# EAGLE design PersonalPCR_EagleCad_v1 (EAGLE 5.11)
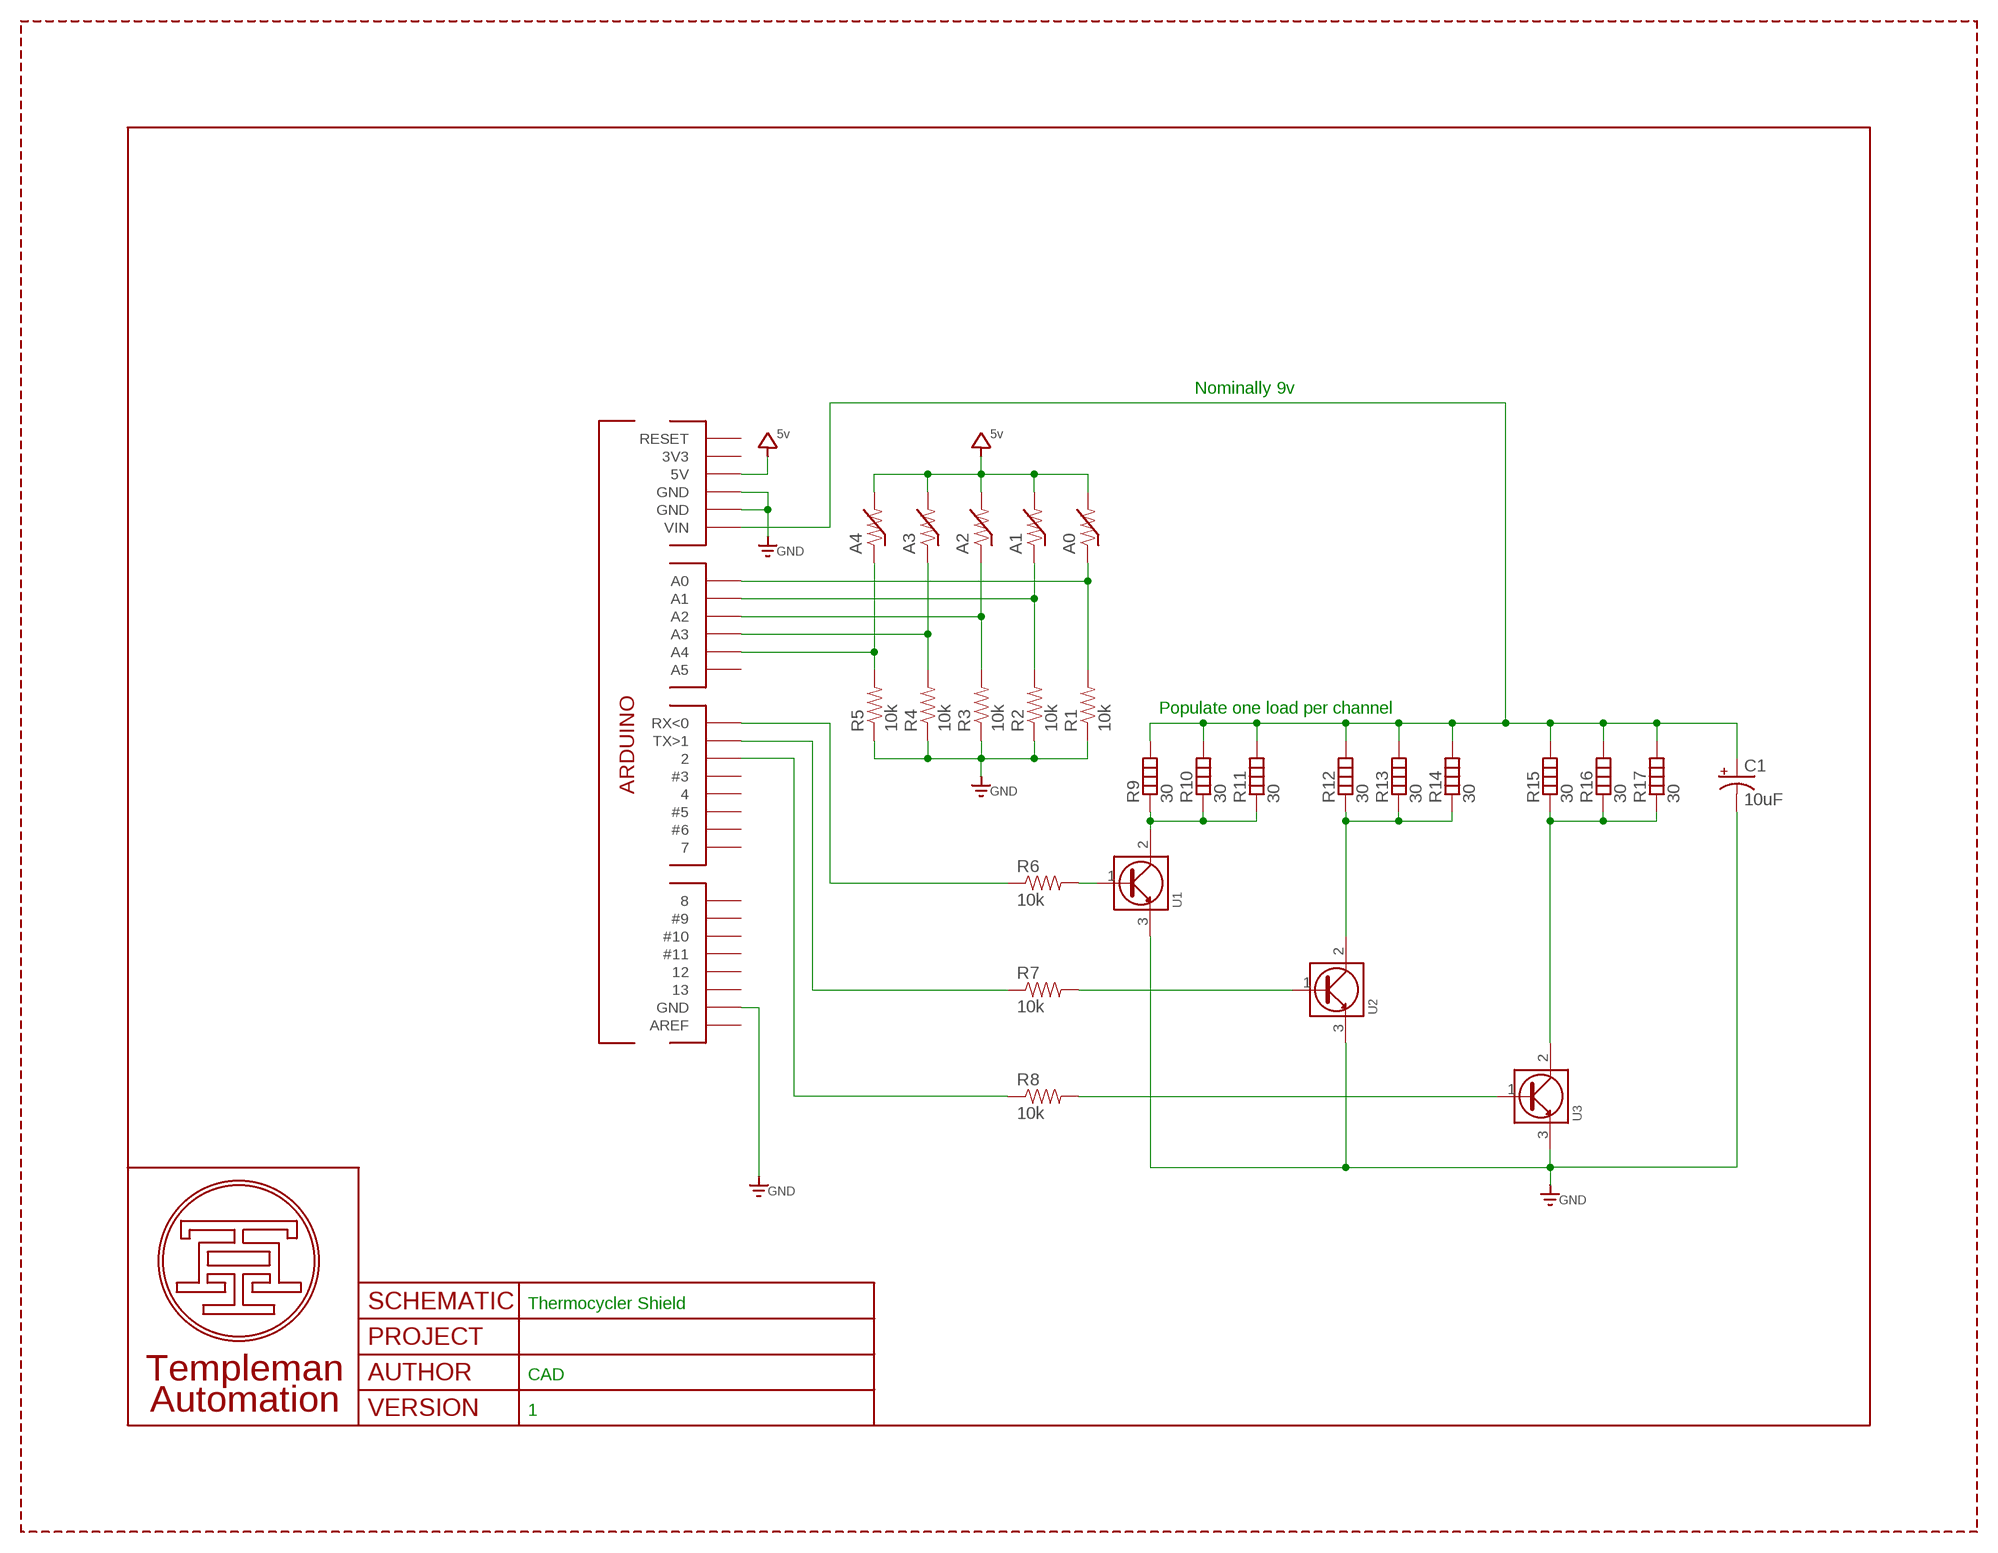
[diagram p0: schematic, sheet 1]

## Parts
A0  THERMISTOR_HEADER  [HEADER_2PIN]
A1  THERMISTOR_HEADER  [HEADER_2PIN]
A2  THERMISTOR_HEADER  [HEADER_2PIN]
A3  THERMISTOR_HEADER  [HEADER_2PIN]
A4  THERMISTOR_HEADER  [HEADER_2PIN]
C1  10uF  CAP_POLPANASONIC_EB_A  [CPOL-RADIAL_5MMCASE_2MMPINS]
R1  10k  RESISTOR2512W  [2512_WIDE]
R2  10k  RESISTOR2512W  [2512_WIDE]
R3  10k  RESISTOR2512W  [2512_WIDE]
R4  10k  RESISTOR2512W  [2512_WIDE]
R5  10k  RESISTOR2512W  [2512_WIDE]
R6  10k  RESISTOR1206  [1206]
R7  10k  RESISTOR1206  [1206]
R8  10k  RESISTOR1206  [1206]
R9  30  RESISTOR_HEATER_2512  [2512]
R10  30  RESISTOR_HEATER_HEADER  [HEADER_2PIN]
R11  30  RESISTOR_HEATER_BIGBLOCK  [RECTILINEAR_RESISTOR]
R12  30  RESISTOR_HEATER_2512  [2512]
R13  30  RESISTOR_HEATER_HEADER  [HEADER_2PIN]
R14  30  RESISTOR_HEATER_BIGBLOCK  [RECTILINEAR_RESISTOR]
R15  30  RESISTOR_HEATER_2512  [2512]
R16  30  RESISTOR_HEATER_HEADER  [HEADER_2PIN]
R17  30  RESISTOR_HEATER_BIGBLOCK  [RECTILINEAR_RESISTOR]
U1  NPN_BJT_SOT223  [SOT-223]
U2  NPN_BJT_SOT223  [SOT-223]
U3  NPN_BJT_SOT223  [SOT-223]
U$1  PAPER_LETTER_LANDSCAPE  [NULL]
U$2  ARDUINO_SHIELD  [ARDUINO_UNO_SHIELD]

## Nets
5V: A0.2 A1.2 A2.2 A3.2 A4.2 U$2.5V ; supply symbol labelled SYM_5V
GND: C1.- R1.1 R2.1 R3.1 R4.1 R5.1 U1.3(E) U2.3(E) U3.3(E) U$2.GND@1(GND) U$2.GND@2(GND) U$2.GND@3(GND) ; supply symbol labelled SYM_GND
N$1: C1.+ R9.2 R10.2 R11.2 R12.2 R13.2 R14.2 R15.2 R16.2 R17.2 U$2.VIN
N$2: A0.1 R1.2 U$2.A0
N$3: A1.1 R2.2 U$2.A1
N$4: R6.1 U$2.RX<0
N$5: R7.1 U$2.TX>1
N$6: R8.1 U$2.2
N$7: R6.2 U1.1(B)
N$8: R7.2 U2.1(B)
N$9: R8.2 U3.1(B)
N$10: A2.1 R3.2 U$2.A2
N$11: A3.1 R4.2 U$2.A3
N$12: A4.1 R5.2 U$2.A4
N$13: R9.1 R10.1 R11.1 U1.2(C)
N$14: R12.1 R13.1 R14.1 U2.2(C)
N$15: R15.1 R16.1 R17.1 U3.2(C)
Unconnected: U$2.3(#3) U$2.3V3 U$2.4 U$2.5(#5) U$2.6(#6) U$2.7 U$2.8 U$2.9(#9) U$2.10(#10) U$2.11(#11) U$2.12 U$2.13 U$2.A5 U$2.AREF U$2.RESET

## Notes on the sheet
- Nominally 9v
- Populate one load per channel
- Thermocycler Shield
- CAD
- 1

## Library data of the parts
A0 A1-A4 = templeman:THERMISTOR
C1 = templeman:CAP_POL: Capacitor Polarized These are standard SMD and PTH capacitors. Normally 10uF, 47uF, and 100uF in electrolytic and tantalum varieties. Always verify the external diameter of the through hole cap, it varies with capacity, voltage, and manufacturer. The EIA devices should be standard.
R1-R8 = templeman:RESISTOR: Resistor Basic schematic elements and footprints for 0603, 1206, and PTH 1/10th watt (small) resistors.
R9-R17 = templeman:RESISTOR_HEATER
U1-U3 = templeman:NPN_BJT
U$1 = templeman:PAPER_LETTER_LANDSCAPE: Layout for Standard Letter Paper
U$2 = templeman:ARDUINO_SHIELD

## Board
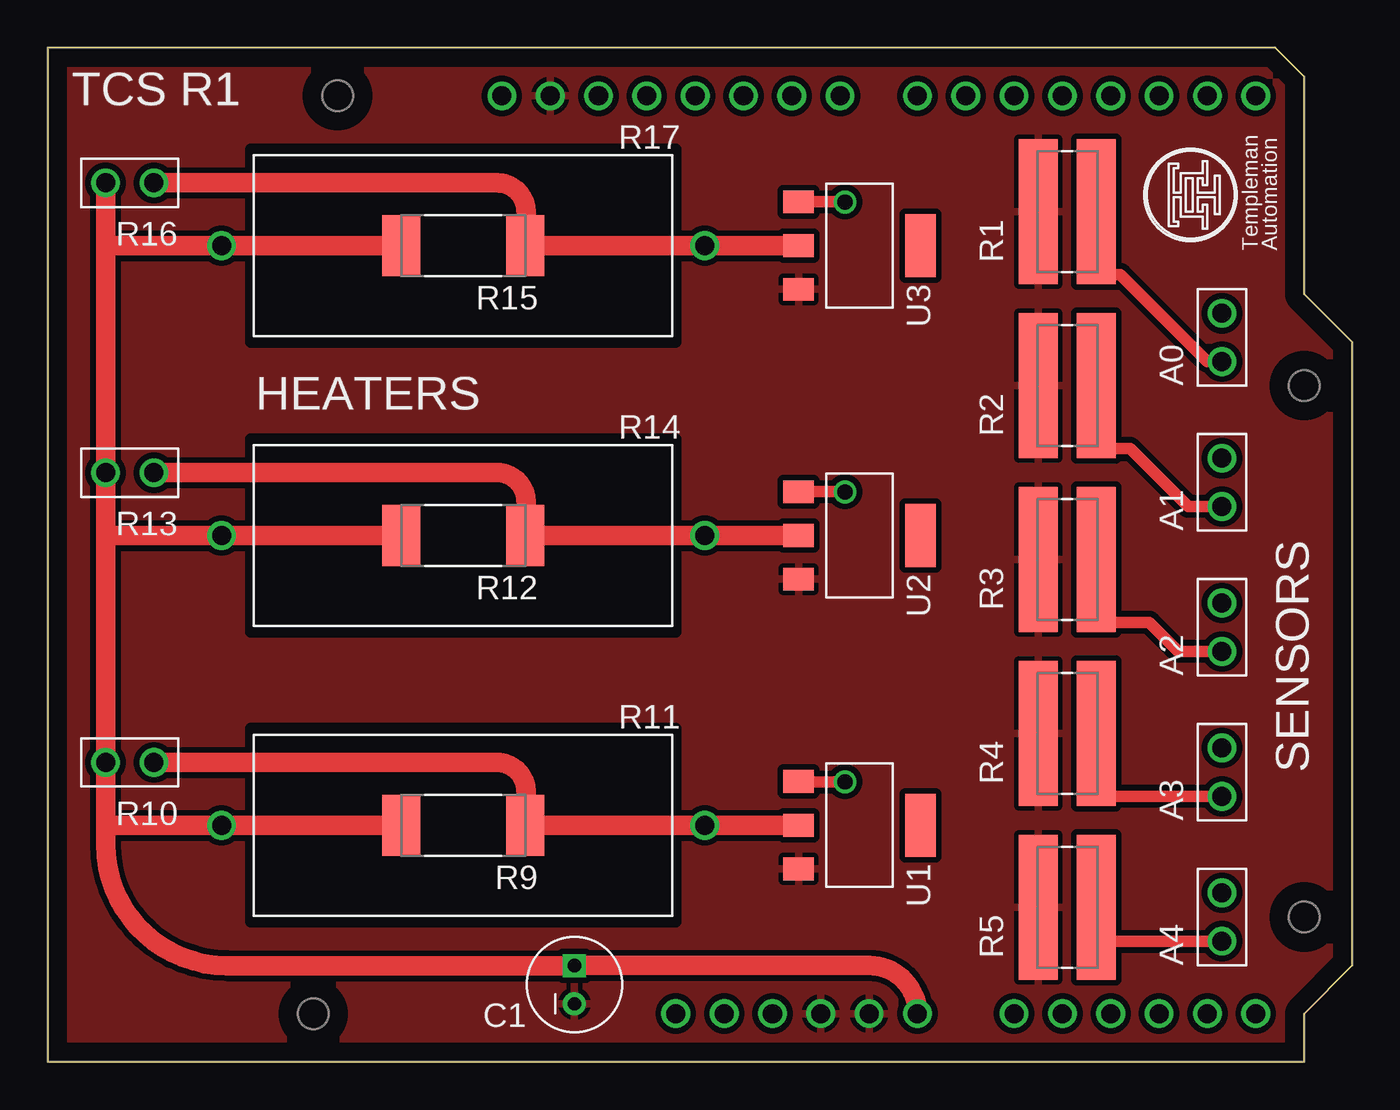
[diagram p1: board, top side]
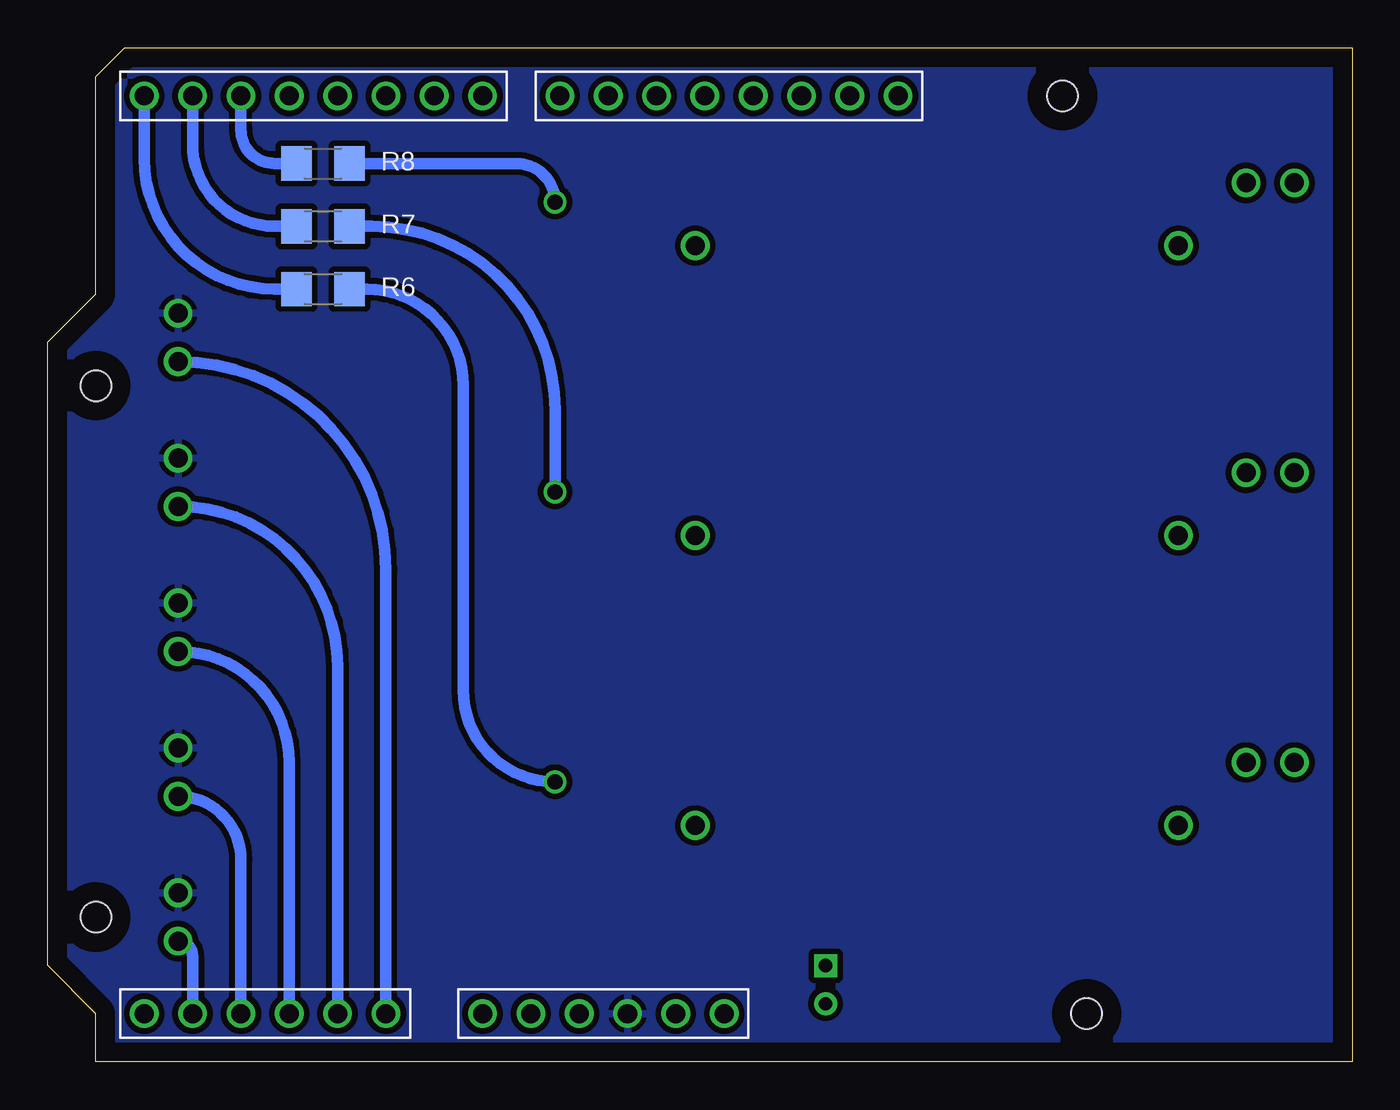
[diagram p2: board, bottom side, seen from below]

Size 68.58 x 53.34 mm. Coordinates in mm from the lower left corner, seen from the top.
Outline: 0,0 66.04,0 66.04,2.54 68.58,5.08 68.58,37.85 66.04,40.39 66.04,51.82 64.52,53.34 0,53.34 0,0
Copper layers (1*16): Top 0.035mm / dielectric 1.5mm / Bottom 0.035mm
Design rules "barebones": minimum track width 10mil, minimum drill 15mil, track to track 12mil, track to pad 12mil, pad to pad 12mil, via to via 12mil, smd to smd 12mil, copper to edge 40mil, drill to drill 12mil, minimum pad ring 10mil, minimum via ring 8mil, stop-mask expansion 4mil, vias tented up to drill 0mil, thermal gap 10mil
Holes 1.6 mm at 13.97,2.54 15.24,50.8 66.04,35.56 66.04,7.62
tRestrict: area 10.7,37.8 to 33,48; area 10.7,22.6 to 33,32.8; area 10.7,7.4 to 33,17.5

### Footprints (pad centres in the part's own frame; a part is rotated, then mirrored left to right if it is on the bottom)
HEADER_2PIN = drill 1 round: 1 0,0; 2 2.54,0
CPOL-RADIAL_5MMCASE_2MMPINS = drill 0.7 square: + 1,0 | drill 0.7 round: - -1,0
2512_WIDE = smd 2.032 x 7.62: 1 -1.524,0; 2 1.524,0
1206 = smd 1.6 x 1.8: 1 -1.4,0; 2 1.4,0
2512 = smd 2 x 3.2: 1 -3.25,0; 2 3.25,0
RECTILINEAR_RESISTOR = drill 1 round: 1 -12.7,0; 2 12.7,0
SOT-223 = smd 1.2 x 1.6: 1 -2.3,-3.2; 2 0,-3.2; 3 2.3,-3.2 | smd 3.3 x 1.6: 4 0,3.2
ARDUINO_UNO_SHIELD = drill 1 round: 2 -5.08,48.26; 3 -7.62,48.26; 3V3 -27.94,0; 4 -10.16,48.26; 5 -12.7,48.26; 5V -25.4,0; 6 -15.24,48.26; 7 -17.78,48.26; 8 -21.844,48.26; 9 -24.384,48.26; 10 -26.924,48.26; 11 -29.464,48.26; 12 -32.004,48.26; 13 -34.544,48.26; A0 -12.7,0; A1 -10.16,0; A2 -7.62,0; A3 -5.08,0; A4 -2.54,0; A5 0,0; AREF -39.624,48.26; GND@1 -22.86,0; GND@2 -20.32,0; GND@3 -37.084,48.26; RESET -30.48,0; RX<0 0,48.26; TX>1 -2.54,48.26; VIN -17.78,0

### Placement (x,y rotation side)
A0  61.72,36.83 90 top
A1  61.72,29.21 90 top
A2  61.72,21.59 90 top
A3  61.72,13.97 90 top
A4  61.72,6.35 90 top
C1  27.69,4.06 90 top
R1  53.59,44.7 0 top
R2  53.59,35.56 0 top
R3  53.59,26.42 0 top
R4  53.59,17.27 0 top
R5  53.59,8.13 0 top
R6  54.1,40.64 0 bottom
R7  54.1,43.94 0 bottom
R8  54.1,47.24 0 bottom
R9  21.84,12.45 180 top
R10  5.59,15.75 180 top
R11  21.84,12.45 180 top
R12  21.84,27.69 180 top
R13  5.59,30.99 180 top
R14  21.84,27.69 180 top
R15  21.84,42.93 180 top
R16  5.59,46.23 180 top
R17  21.84,42.93 180 top
U1  42.67,12.45 270 top
U2  42.67,27.69 270 top
U3  42.67,42.93 270 top
U$1  1.27,1.27 0 top
U$2  63.5,2.54 0 top
U$8  [LOGO-TA]  59.44,45.21 90 top

### Tracks (layer width: path | path; a pad name or v marks a point on that pad's centre or on a via)
5V
  pour Bottom: 0,0 66.04,0 66.04,2.54 68.58,5.08 68.58,37.85 66.04,40.39 66.04,51.82 64.52,53.34 0,53.34
GND
  pour Top: 0,53.34 64.52,53.34 66.04,51.82 66.04,40.39 68.58,37.85 68.58,5.08 66.04,2.54 66.04,0 0,0
N$1
  Top 1.016: 3.05,12.45 R10.2 3.05,27.69 | 3.05,12.45 R11.2 R9.2 | 3.05,27.69 R13.2 3.05,42.93 | 3.05,42.93 R16.2 | 3.05,27.69 R14.2 R12.2 | 3.05,42.93 R17.2 R15.2 | U$2.VIN arc90 43.18,5.08 27.7,5.08 C1.+ 9.41,5.06 arc-90 3.05,11.43 3.05,12.45
N$2
  Top 0.61: R1.2 55.12,41.4 56.39,41.4 60.96,36.83 A0.1
  Bottom 0.61: U$2.A0 50.8,25.91 arc-90 A0.1
N$3
  Top 0.61: R2.2 55.12,32.26 56.9,32.26 59.94,29.21 A1.1
  Bottom 0.61: U$2.A1 53.34,20.83 arc-90 A1.1
N$4
  Bottom 0.61: U$2.RX<0 63.5,47.5 arc-90 56.64,40.64 R6.1
N$5
  Bottom 0.61: U$2.TX>1 60.96,48.26 arc-90 56.64,43.94 R7.1
N$6
  Bottom 0.61: U$2.2 58.42,49.02 arc-90 56.64,47.24 R8.1
N$7  (via drill 0.8)
  Top 0.61: U1.1 39.49,14.73 v41.91,14.73
  Bottom 0.61: R6.2 51.82,40.64 arc90 46.74,35.56 46.74,19.56 arc-90 v41.91,14.73
N$8  (via drill 0.8)
  Top 0.61: U2.1 41.9,29.99 v41.91,29.97
  Bottom 0.61: v41.91,29.97 41.91,34.29 arc-90 51.56,43.94 R7.2
N$9  (via drill 0.8)
  Top 0.61: U3.1 41.9,45.23 v41.91,45.21
  Bottom 0.61: R8.2 43.94,47.24 arc90 v41.91,45.21
N$10
  Top 0.61: R3.2 55.12,23.11 57.91,23.11 59.44,21.59 A2.1
  Bottom 0.61: U$2.A2 55.88,15.75 arc-90 A2.1
N$11
  Top 0.61: R4.2 55.12,13.97 A3.1
  Bottom 0.61: A3.1 arc90 58.42,10.67 U$2.A3
N$12
  Top 0.61: R5.2 55.12,6.35 A4.1
  Bottom 0.61: A4.1 arc90 60.96,5.59 U$2.A4
N$13
  Top 1.016: U1.2 R11.1 R9.1 arc90 25.15,12.5 25.15,14.22 arc90 23.62,15.75 R10.1
N$14
  Top 1.016: R12.1 R14.1 U2.2 | 25.15,27.74 R12.1 | R13.1 23.62,30.99 arc-90 25.15,29.46 25.15,27.74 | 25.15,27.74 arc-90 R12.1
N$15
  Top 1.016: U3.2 R17.1 R15.1 arc90 25.15,42.98 25.15,44.7 arc90 23.62,46.23 R16.1

### Text on the board
tPlace: TCS R1 | HEATERS | SENSORS